# EAGLE design AIO_tracker_V1.0 (EAGLE 6.5.0)
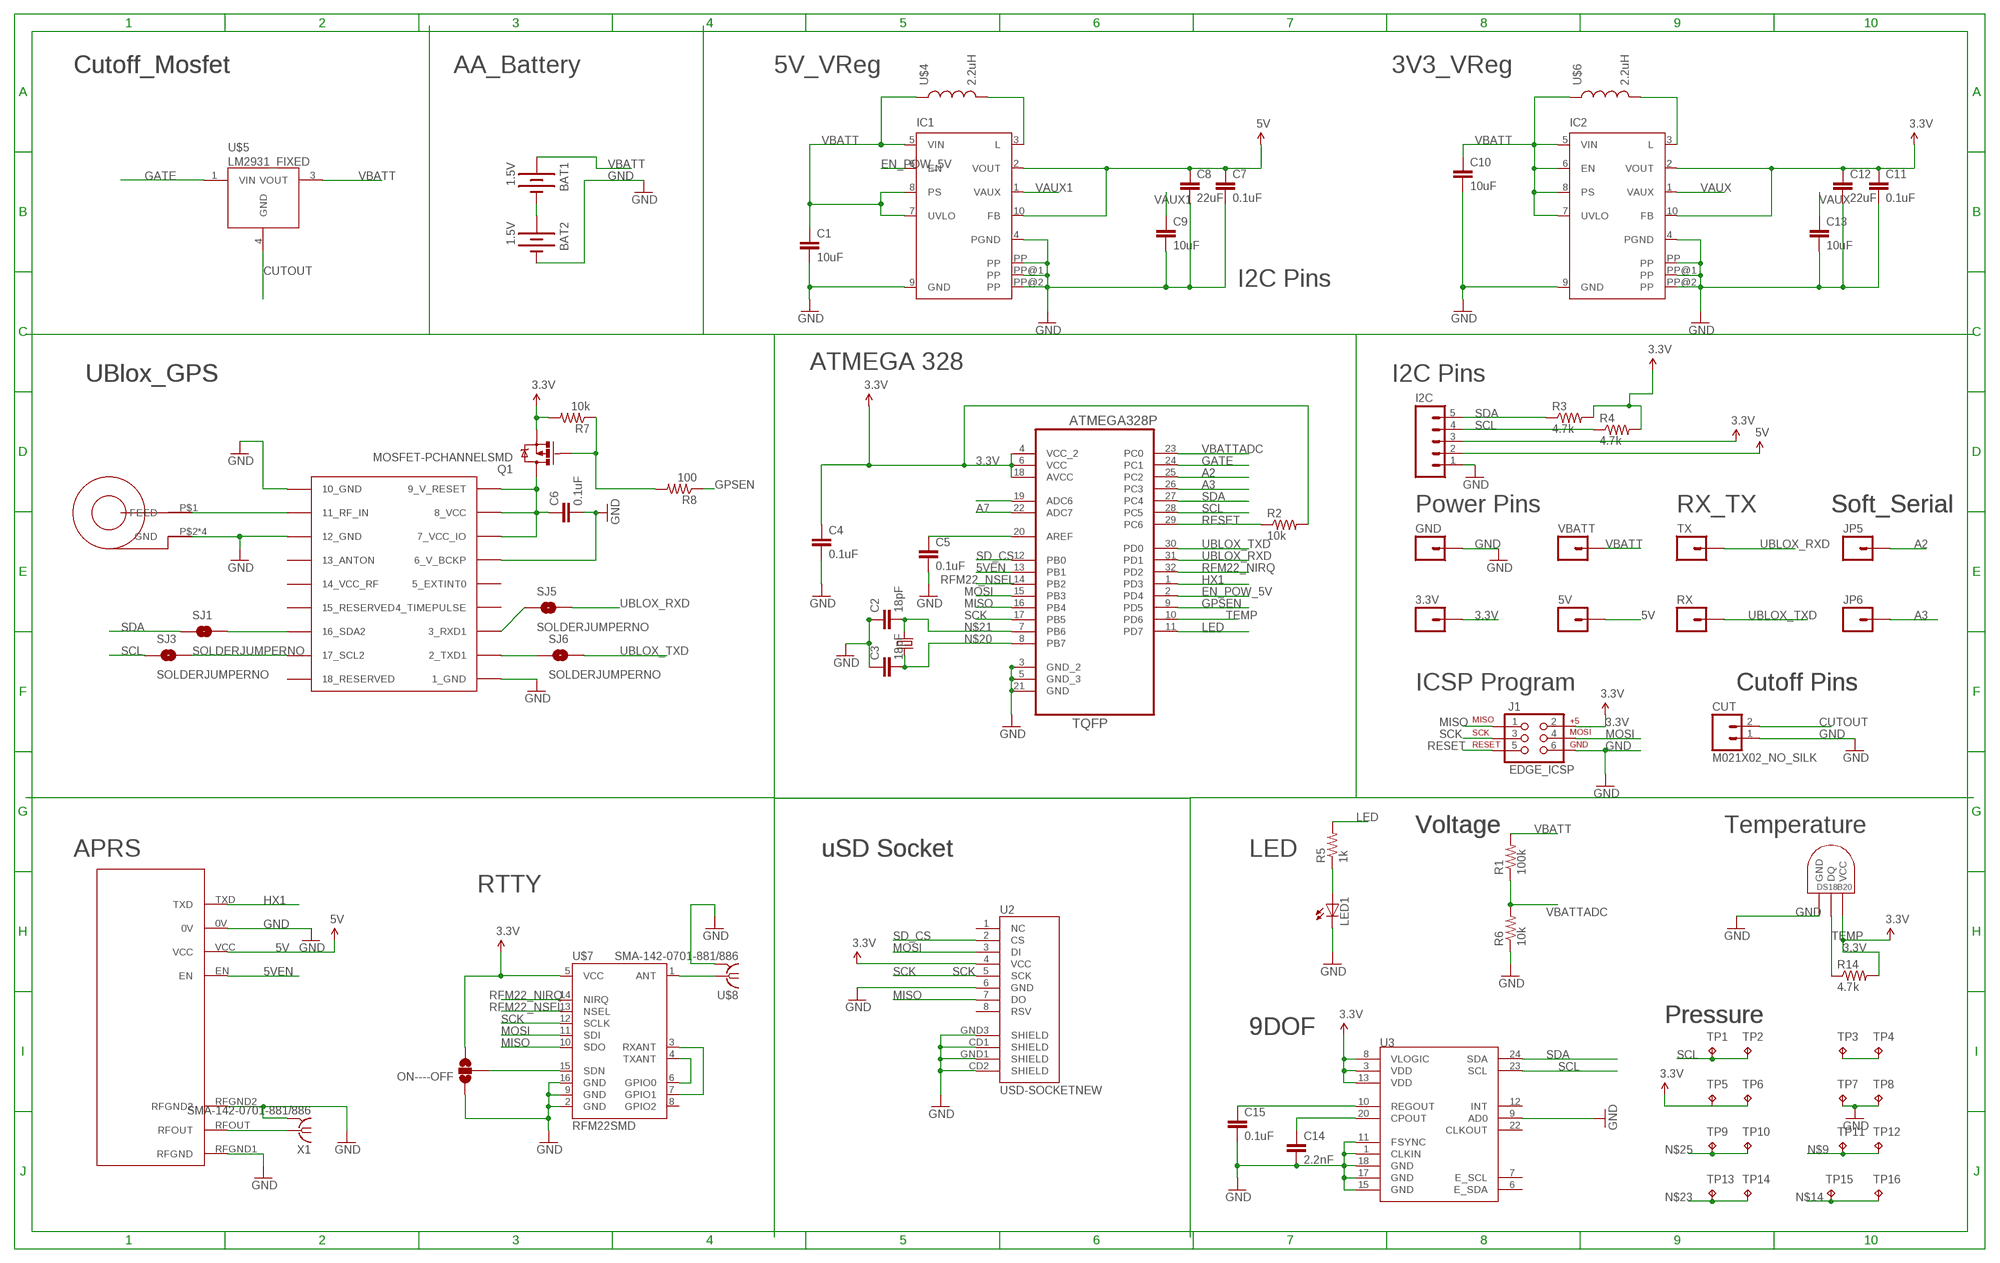
[diagram p0: schematic, sheet 1]

## Parts
3.3V  M01SMDNS  [1X01NS]
5V  M01SMDNS  [1X01NS]
BAT1  1.5V  BATTERYAA-KIT  [BATTERY-AA-KIT]
BAT2  1.5V  BATTERYAA-KIT  [BATTERY-AA-KIT]
C1  10uF  CAP0805  [0805]
C2  18pF  CAP0603-CAP  [0603-CAP]
C3  18pF  CAP0603-CAP  [0603-CAP]
C4  0.1uF  CAP0603-CAP  [0603-CAP]
C5  0.1uF  CAP0603-CAP  [0603-CAP]
C6  0.1uF  CAP0603-CAP  [0603-CAP]
C7  0.1uF  CAP0603-CAP  [0603-CAP]
C8  22uF  CAP0805  [0805]
C9  10uF  CAP0805  [0805]
C10  10uF  CAP0805  [0805]
C11  0.1uF  CAP0603-CAP  [0603-CAP]
C12  22uF  CAP0805  [0805]
C13  10uF  CAP0805  [0805]
C14  2.2nF  CAP0603-CAP  [0603-CAP]
C15  0.1uF  CAP0603-CAP  [0603-CAP]
CUT  M021X02_NO_SILK  [1X02_NO_SILK]
GND  M01SMDNS  [1X01NS]
I2C  M05NO_SILK  [1X05_NO_SILK]
IC1  TPS61201  [S-PDSO-N10]
IC2  TPS61201  [S-PDSO-N10]
J1  EDGE_ICSP  [EDGE_MOUNTED_ICSP]
JP5  M01PTH  [1X01]
JP6  M01PTH  [1X01]
LED1  LED0603  [LED-0603]
ON----OFF  SOLDERJUMPER_2WAY-OLDT  [SJ_2]
Q1  MOSFET-PCHANNELSMD  [SOT23-3]
R1  100k  RESISTOR0603-RES  [0603-RES]
R2  10k  RESISTOR0603-RES  [0603-RES]
R3  4.7k  RESISTOR0603-RES  [0603-RES]
R4  4.7k  RESISTOR0603-RES  [0603-RES]
R5  1k  RESISTOR0603-RES  [0603-RES]
R6  10k  RESISTOR0603-RES  [0603-RES]
R7  10k  RESISTOR0603-RES  [0603-RES]
R8  100  RESISTOR0603-RES  [0603-RES]
R14  4.7k  RESISTOR0603-RES  [0603-RES]
RX  M01PTH  [1X01]
SJ1  SOLDERJUMPERNO  [SJ_2S-NO]
SJ3  SOLDERJUMPERNO  [SJ_2S-NO]
SJ5  SOLDERJUMPERNO  [SJ_2S-NO]
SJ6  SOLDERJUMPERNO  [SJ_2S-NO]
TP1  TPTP10SQ  [TP10SQ]
TP2  TPTP10SQ  [TP10SQ]
TP3  TPTP10SQ  [TP10SQ]
TP4  TPTP10SQ  [TP10SQ]
TP5  TPTP10SQ  [TP10SQ]
TP6  TPTP10SQ  [TP10SQ]
TP7  TPTP10SQ  [TP10SQ]
TP8  TPTP10SQ  [TP10SQ]
TP9  TPTP10SQ  [TP10SQ]
TP10  TPTP10SQ  [TP10SQ]
TP11  TPTP10SQ  [TP10SQ]
TP12  TPTP10SQ  [TP10SQ]
TP13  TPTP10SQ  [TP10SQ]
TP14  TPTP10SQ  [TP10SQ]
TP15  TPTP10SQ  [TP10SQ]
TP16  TPTP10SQ  [TP10SQ]
TX  M01PTH  [1X01]
U1  ATMEGA328P-AU  [QFP80P900X900X120-32N]
U2  USD-SOCKETNEW  [MICRO-SD-SOCKET-PP]
U3  MPU-9150QFN-24-NP  [QFN-24-NP]
U$1  UBLOX_MAX  [UBLOX_MAX]
U$2  JDGA-REMQV-ANTENNA  [JDGA-RIGID_COMBO_PAD]
U$3  NTX2-VERTICAL  [NTX2-VERTICAL]
U$4  2.2uH  COILCRAFT-MSS5131  [COILCRAFT_MSS5131]
U$5  LM2931_FIXED  [DPAK]
U$6  2.2uH  COILCRAFT-MSS5131  [COILCRAFT_MSS5131]
U$7  RFM22SMD  [RFM22-XXX-S2]
U$8  SMA-142-0701-881/886  [J502-ND-142-0701-881/886]
U$9  DS1820  [µSOP8]
VBATT  M01SMDNS  [1X01NS]
X1  SMA-142-0701-881/886  [J502-ND-142-0701-881/886]
Y1  ABRACON_ABM3_CRYSTAL  [ABRACON_ABM3_CRYSTAL]

## Nets
3.3V [3.3V]: 3.3V.1 C4.1 C11.1 C12.1 I2C.3 IC2.2(VOUT) IC2.10(FB) J1.2 ON----OFF.3 Q1.2(S) R2.2 R3.2 R4.2 R7.2 R14.2 TP5.TP TP6.TP U1.4(VCC_2) U1.6(VCC) U1.18(AVCC) U2.4(VCC) U3.3(VDD) U3.8(VLOGIC) U3.13(VDD) U$7.5(VCC) U$9.8(VCC)
5V [5V]: 5V.1 C7.1 C8.1 I2C.2 IC1.2(VOUT) IC1.10(FB) U$3.VCC
5VEN: U1.13(PB1) U$3.EN
A2: JP5.1 U1.25(PC2)
A3: JP6.1 U1.26(PC3)
A7: U1.22(ADC7)
CUTOUT: CUT.2 U$5.4(GND)
EN_POW_5V: IC1.6(EN) U1.2(PD4)
GATE: U1.24(PC1) U$5.1(VIN)
GND [GND]: BAT2.GND@1(-) C1.2 C2.1 C3.1 C4.2 C5.2 C6.2 C7.2 C8.2 C9.2 C10.2 C11.2 C12.2 C13.2 C14.2 C15.2 CUT.1 GND.1 I2C.1 IC1.4(PGND) IC1.9(GND) IC1.PP IC1.PP@1(PP) IC1.PP@2(PP) IC2.4(PGND) IC2.9(GND) IC2.PP IC2.PP@1(PP) IC2.PP@2(PP) J1.6 LED1.C ON----OFF.1 R6.1 TP7.TP TP8.TP U1.3(GND_2) U1.5(GND_3) U1.21(GND) U2.6(GND) U2.CD1(SHIELD) U2.CD2(SHIELD) U2.GND1(SHIELD) U2.GND3(SHIELD) U3.1(CLKIN) U3.9(AD0) U3.11(FSYNC) U3.15(GND) U3.17(GND) U3.18(GND) U$1.1_GND U$1.6_V_BCKP U$1.10_GND U$1.12_GND U$2.P$2(GND) U$2.P$3(GND) U$2.P$4(GND) U$2.P$5(GND) U$3.0V U$3.RFGND1(RFGND) U$3.RFGND2 U$7.2(GND) U$7.9(GND) U$7.16(GND) U$8.G@1 U$8.G@2 U$8.G@3 U$8.G@4 U$9.4(GND) X1.G@1 X1.G@2 X1.G@3 X1.G@4
GPSEN: R8.1 U1.9(PD5)
HX1: U1.1(PD3) U$3.TXD
LED: R5.2 U1.11(PD7)
MISO: J1.1 U1.16(PB4) U2.7(DO) U$7.10(SDO)
MOSI: J1.4 U1.15(PB3) U2.3(DI) U$7.11(SDI)
N$1: LED1.A R5.1
N$2: Q1.1(G) R7.1 R8.2
N$3: U$1.11_RF_IN U$2.P$1(FEED)
N$4: C5.1 U1.20(AREF)
N$5: U$3.RFOUT X1.1
N$6: C6.1 Q1.3(D) U$1.7_VCC_IO U$1.8_VCC U$1.9_V_RESET
N$7: IC1.3(L) U$4.P$1
N$9: TP11.TP TP12.TP
N$10: BAT1.GND@1(-) BAT2.PWR@1(+)
N$11: SJ5.1 U$1.3_RXD1
N$12: SJ6.1 U$1.2_TXD1
N$13: U$7.1(ANT) U$8.1
N$14: TP15.TP TP16.TP
N$15: SJ1.2 U$1.16_SDA2
N$16: SJ3.2 U$1.17_SCL2
N$17: C15.1 U3.10(REGOUT)
N$18: C14.1 U3.20(CPOUT)
N$19: IC2.3(L) U$6.P$1
N$20: C3.2 U1.8(PB7) Y1.P$1
N$21: C2.2 U1.7(PB6) Y1.P$2
N$23: TP13.TP TP14.TP
N$24: U1.19(ADC6)
N$25: TP9.TP TP10.TP
N$26: ON----OFF.2 U$7.15(SDN)
N$29: U$7.3(RXANT) U$7.7(GPIO1)
N$30: U$7.4(TXANT) U$7.6(GPIO0)
RESET: J1.5 R2.1 U1.29(PC6)
RFM22_NIRQ: U1.32(PD2) U$7.14(NIRQ)
RFM22_NSEL: U1.14(PB2) U$7.13(NSEL)
SCK: J1.3 U1.17(PB5) U2.5(SCK) U$7.12(SCLK)
SCL: I2C.4 R4.1 SJ3.1 TP1.TP TP2.TP U1.28(PC5) U3.23(SCL)
SD_CS: U1.12(PB0) U2.2(CS)
SDA: I2C.5 R3.1 SJ1.1 TP3.TP TP4.TP U1.27(PC4) U3.24(SDA)
TEMP: R14.1 U1.10(PD6) U$9.1(DQ)
UBLOX_RXD: SJ5.2 TX.1 U1.31(PD1)
UBLOX_TXD: RX.1 SJ6.2 U1.30(PD0)
VAUX: C13.1 IC2.1(VAUX)
VAUX1: C9.1 IC1.1(VAUX)
VBATT [bat]: BAT1.PWR@1(+) C1.1 C10.1 IC1.5(VIN) IC1.7(UVLO) IC1.8(PS) IC2.5(VIN) IC2.6(EN) IC2.7(UVLO) IC2.8(PS) R1.2 U$4.P$2 U$5.3(VOUT) U$6.P$2 VBATT.1
VBATTADC: R1.1 R6.2 U1.23(PC0)
Unconnected: U2.1(NC) U2.8(RSV) U3.6(E_SDA) U3.7(E_SCL) U3.12(INT) U3.22(CLKOUT) U$1.4_TIMEPULSE U$1.5_EXTINT0 U$1.13_ANTON U$1.14_VCC_RF U$1.15_RESERVED U$1.18_RESERVED U$7.8(GPIO2)

## Notes on the sheet
- Cutoff_Mosfet | Cutoff_Mosfet | AA_Battery | 5V_VReg | 3V3_VReg
- I2C Pins
- ATMEGA 328
- UBlox_GPS | UBlox_GPS | I2C Pins
- Power Pins | RX_TX | Soft_Serial | Soft_Serial
- ICSP Program | Cutoff Pins | Cutoff Pins
- Voltage | Voltage | Temperature
- APRS | uSD Socket | uSD Socket | LED
- RTTY
- Pressure | Pressure
- 9DOF | 9DOF

## Library data of the parts
3.3V 5V GND JP5 JP6 RX TX VBATT = SparkFun-Connectors:M01: Header 1 Standard 1-pin 0.1" header. Use with straight break away headers (SKU : PRT-00116), right angle break away headers (PRT-00553), swiss pins (PRT-00743), machine pins (PRT-00117), and female headers (PRT-00115).
BAT1 BAT2 = SparkFun-Electromechanical:BATTERY: Battery Holders Various common sizes : AA, AAA, 20mm coin cell and 12mm coin cell. 20MM_4LEGS, BATT-10373; PROD_ID: BATT-08316
C1-C15 = SparkFun-Passives:CAP: Capacitor Standard 0603 ceramic capacitor, and 0.1" leaded capacitor.
CUT = SparkFun-Connectors:M02: Standard 2-pin 0.1" header. Use with - straight break away headers ( PRT-00116) - right angle break away headers (PRT-00553) - swiss pins (PRT-00743) - machine pins (PRT-00117) - female headers (PRT-00115) Molex polarized connector foot print use with: PRT-08233 with associated crimp pins and housings. 2.54_SCREWTERM for use with PRT-10571. 3.5mm Screw Terminal footprints for PRT-08084 5mm Screw Terminal footprints for use with PRT-08433
I2C = SparkFun-Connectors:M05: Header 5 Standard 5-pin 0.1" header. Use with straight break away headers (SKU : PRT-00116), right angle break away headers (PRT-00553), swiss pins (PRT-00743), machine pins (PRT-00117), and female headers (PRT-00115). Molex polarized connector foot print use with SKU : PRT-08230 with associated crimp pins and housings.
IC1 IC2 = texas:TPS6120*: LOW INPUT VOLTAGE SYNCHRONOUS BOOST CONVERTER WITH 1.3-A SWITCHES Source: http://focus.ti.com/lit/ds/symlink/tps61200.pdf; MPN: TPS61201DRCT; OC_FARNELL: unknown; OC_NEWARK: 37M0068
J1 = Ava:EDGE_ICSP
LED1 = SparkFun-LED:LED: LEDs Standard schematic elements and footprints for 5mm, 3mm, 1206, and 0603 sized LEDs. 5mm - Spark Fun Electronics SKU : COM-00529 (and others)
ON----OFF = SparkFun-Passives:SOLDERJUMPER_2WAY-OLD: Solder Jumper 2 way solder jumper
Q1 = SparkFun-DiscreteSemi:MOSFET-PCHANNEL: Generic PMOSFET
R1-R8 R14 = SparkFun-Passives:RESISTOR: Resistor Basic schematic elements and footprints for 0603, 1206, and PTH resistors.
SJ1 SJ3 SJ5 SJ6 = SparkFun-Passives:SOLDERJUMPER: Solder Jumper Standard SMD solder jumper. Used to automate production. Two varients : Normally Open and Normally Closed are the same, but have different paste layers. NC will have a large amount of paste and should jumper during reflow.
TP1-TP16 = testpad:TP: Test pad
U1 = Ava:ATMEGA328P-AU; DESCRIPTION: 8-bit Microcontroller with In-System Programmable Flash; MPN: ATMEGA328P-AU; OC_FARNELL: 1715486; OC_NEWARK: 14R4631; PACKAGE: TQFP-32; SUPPLIER: Atmel
U2 = SparkFun-Connectors:USD-SOCKET: microSD Socket Push-push type uSD socket. Schematic element and footprint production proven. Spark Fun Electronics SKU : PRT-00127. tDoc lines correctly indicate media card edge positions when inserting (unlocked, locked, depressed).
U3 = SparkFun-Sensors:MPU-9150: 9DOF (3mag, 3accel, 3rotat). I2C interface.
U$1 = Ava:UBLOX_MAX: UBLOX MAX
U$2 = Ava:JDGA-REMQV-ANTENNA
U$3 = Ava:NTX2-VERTICAL: Radiometrix NTX2 Transmitter Module Author Anthony Stirk / http://ava.upuaut.net
U$4 U$6 = Ava:COILCRAFT-MSS5131
U$5 = SparkFun-PowerIC:LM2931_FIXED: LDO regulator with reverse battery protection- very durable!
U$7 = SparkFun-RF:RFM22: The RFM22 is a low-power, low cost radio that is capable of operating in the 434MHz and 900MHz open bands. It's frequency is software defined and there are some very good libraries written for it.
U$8 X1 = con-coax:SMA-: SMA 50 Ohm End Launch Jack Receptacle - Round Contact Johnson Components Source: www.johnsoncomponents.com .. J502-ND.pdf; MF: JOHNSON COMPONENTS; MPN: 142-0701-881; OC_FARNELL: 1608603; OC_NEWARK: 08B906
U$9 = Ava:DS1820: DS18B20 Programmable Resolution 1-Wire Digital Thermometer Description The DS18B20 digital thermometer provides 9-bit to 12-bit Celsius temperature measurements and has an alarm function with nonvolatile user-programmable upper and lower trigger points. The DS18B20 communicates over a 1-Wire® bus that by definition requires only one data line (and ground) for communication with a central microprocessor. It has an operating temperature range of -55°C to +125°C and is accurate to ±0.5°C over the range of -10°C to +85°C. In addition, the DS18B20 can derive power directly from the data line ("parasite power"), eliminating the need for an external power supply. Each DS18B20 has a unique 64-bit serial code, which allows multiple DS18B20s to function on the same 1-Wire bus. Thus, it is simple to use one microprocessor to control many DS18B20s distributed over a large area. Applications that can benefit from this feature include HVAC environmental controls, temperature monitoring systems inside buildings, equipment, or machinery, and process monitoring and control systems.
Y1 = Ava:ABRACON_ABM3_CRYSTAL

## Net classes
0 default: width 0.254 mm, drill 0.4 mm, clearance 0.254 mm
1 bat: width 0.254 mm, drill 0.4 mm, clearance 0.254 mm to class 0, clearance 0.254 mm
2 5V: width 0.254 mm, drill 0.4 mm, clearance 0.254 mm to class 0, clearance 0.254 mm to class 1, clearance 0.254 mm
3 3.3V: width 0.254 mm, drill 0.4 mm, clearance 0.254 mm to class 0, clearance 0.254 mm to class 1, clearance 0.254 mm to class 2, clearance 0.254 mm
4 GND: width 0.254 mm, drill 0.4 mm, clearance 0.254 mm to class 0, clearance 0.254 mm to class 1, clearance 0.254 mm to class 2, clearance 0.254 mm to class 3, clearance 0.254 mm

## Board
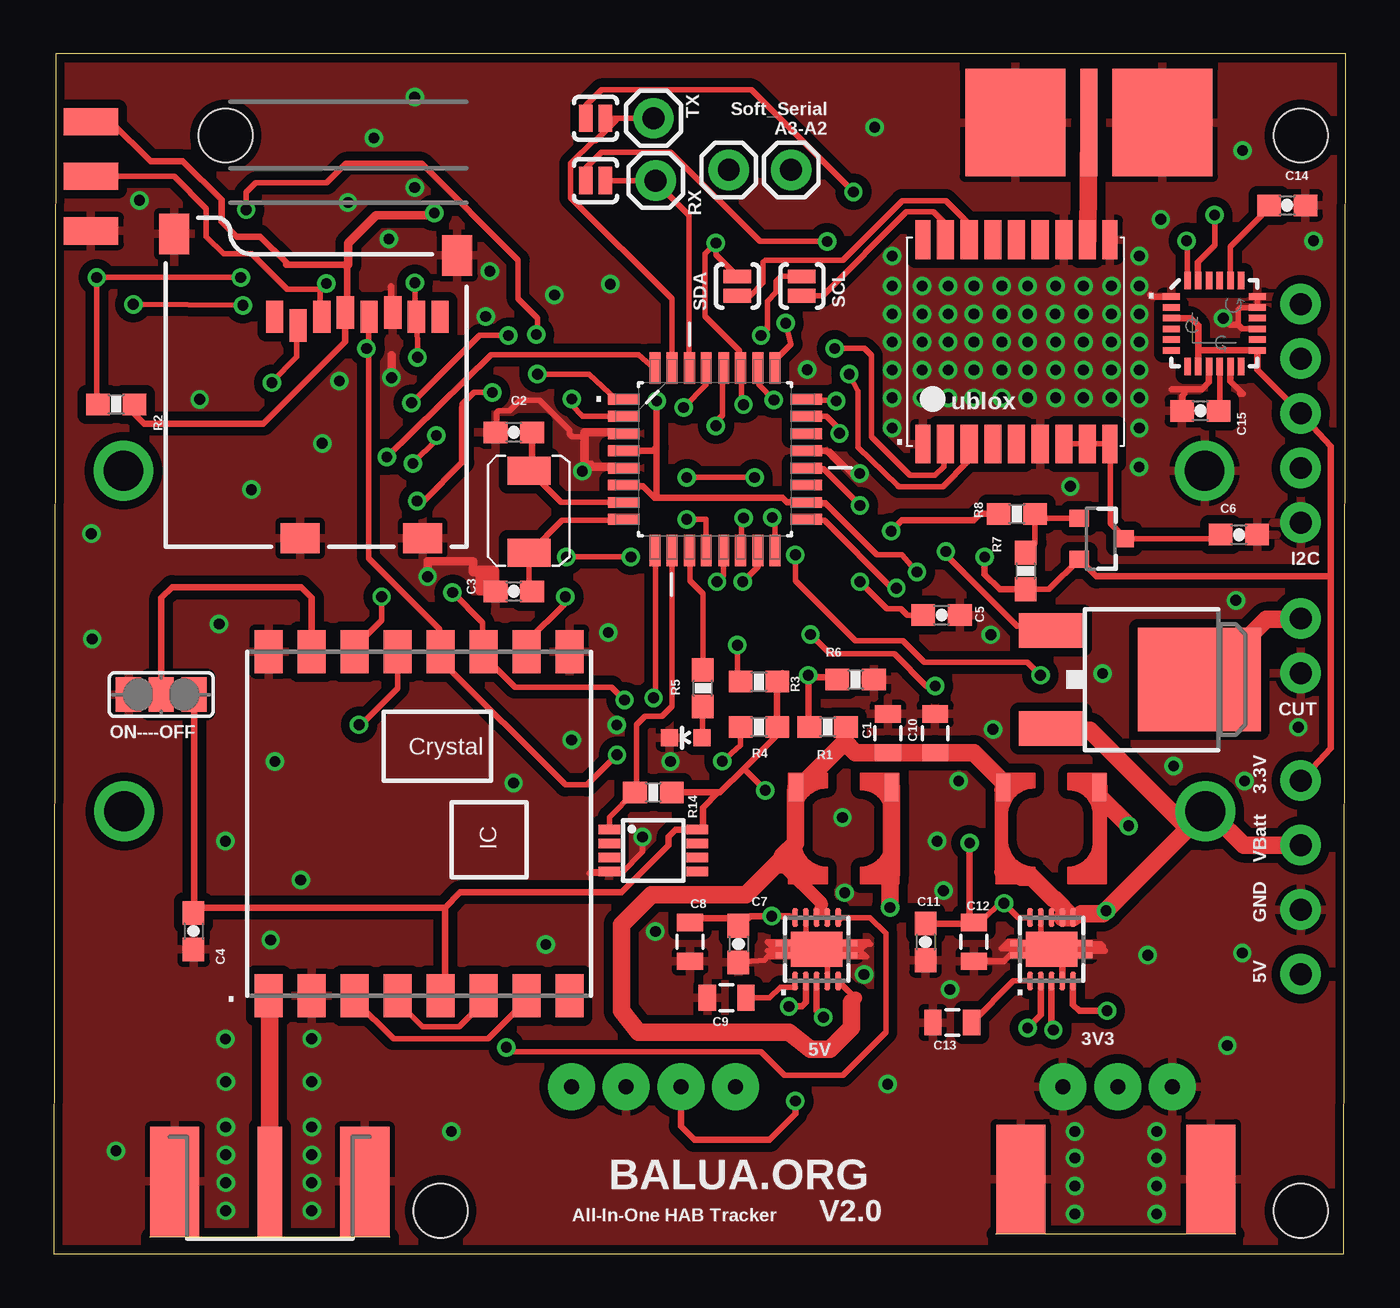
[diagram p1: board, top side]
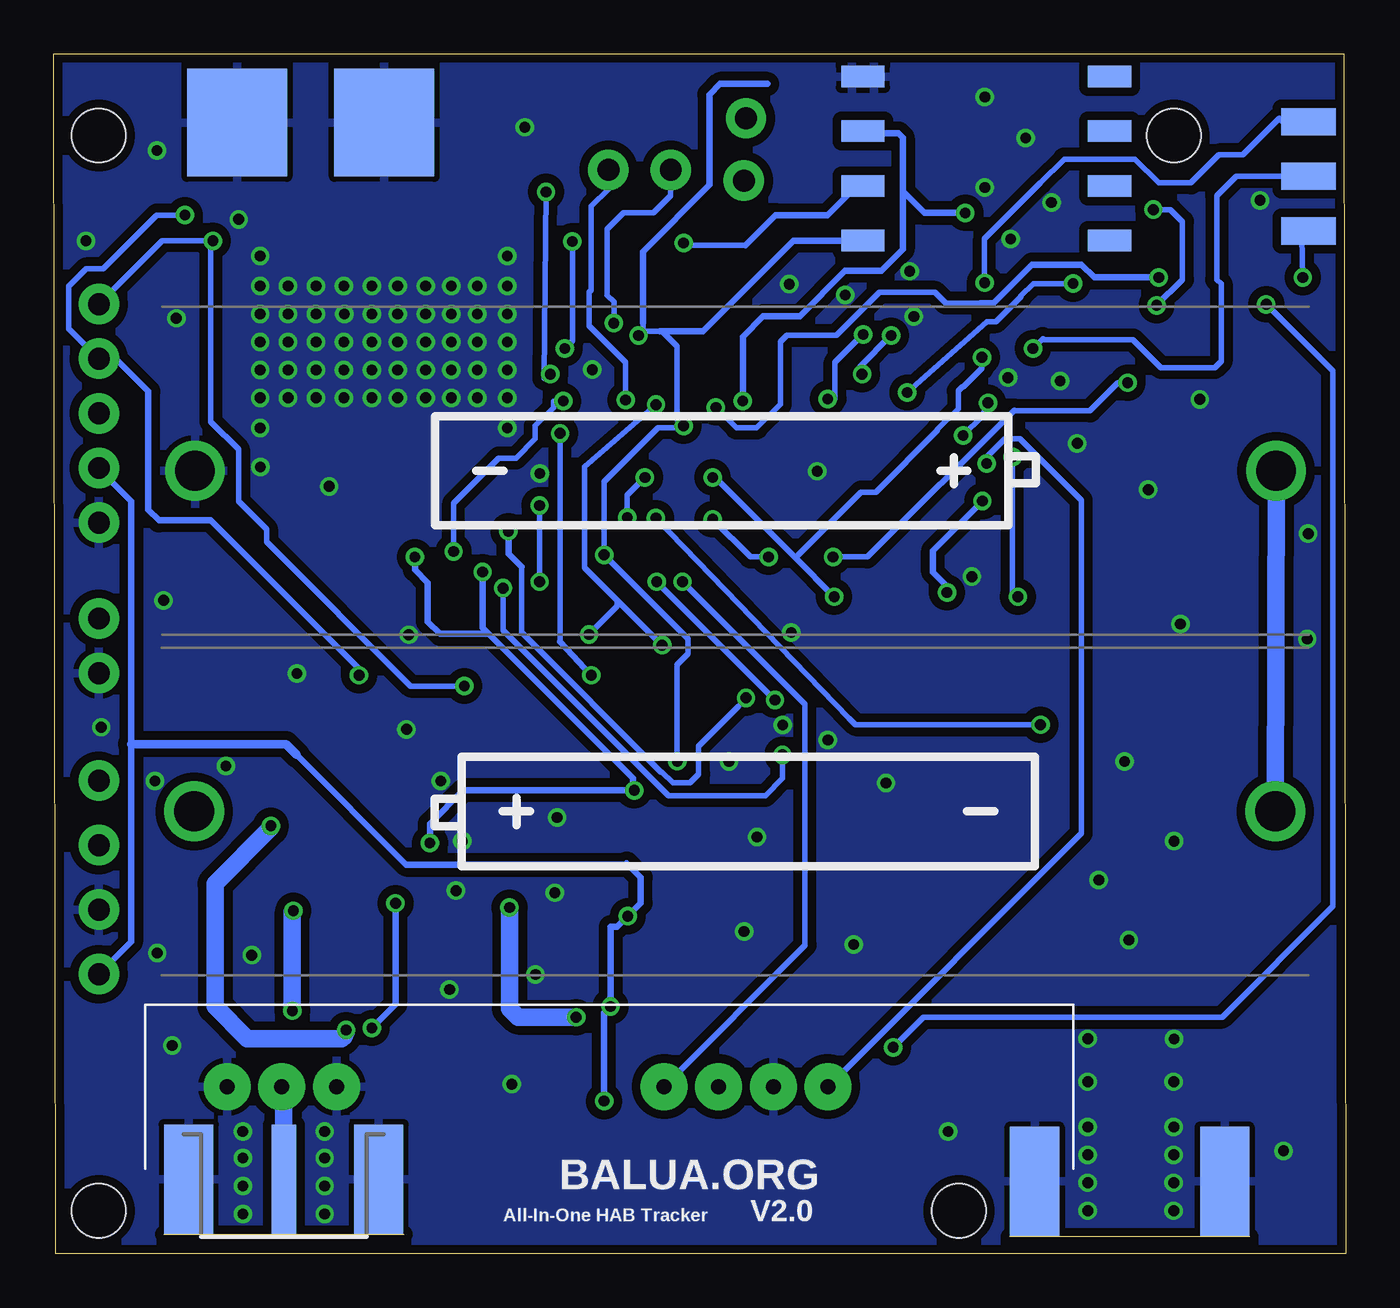
[diagram p2: board, bottom side, seen from below]

Size 60.1 x 55.8 mm. Coordinates in mm from the lower left corner, seen from the top.
Outline: 0,0 60,0 60.1,55.8 0.1,55.8 0,0
Copper layers (1*16): Top 0.0356mm / dielectric 1.5011mm / Bottom 0.0356mm
Design rules "oshpark-2layer *": minimum track width 6mil, minimum drill 13mil, track to track 6mil, track to pad 6mil, pad to pad 6mil, via to via 6mil, smd to smd 6mil, copper to edge 15mil, drill to drill 6mil, minimum pad ring 7mil, minimum via ring 7mil, stop-mask expansion 4mil, vias tented up to drill 25mil, thermal gap 10mil
Holes 2.5 mm at 8,52 18,2 58,2 58,52

### Footprints (pad centres in the part's own frame; a part is rotated, then mirrored left to right if it is on the bottom)
1X01NS = drill 1.016 pad 1.88: 1 0,0
BATTERY-AA-KIT = drill 1.854: GND@1 25.146,0; PWR@1 -25.146,0
0805 = smd 0.8 x 1.2: 1 -0.9,0; 2 0.9,0
0603-CAP = smd 1.1 x 1: 1 -0.85,0; 2 0.85,0
1X02_NO_SILK = drill 1.016 pad 1.88: 1 0,0; 2 2.54,0
1X05_NO_SILK = drill 1.016 pad 1.88: 1 0,0; 2 2.54,0; 3 5.08,0; 4 7.62,0; 5 10.16,0
S-PDSO-N10 = smd 0.28 x 0.85: 1 -1,-1.475; 2 -0.5,-1.475; 3 0,-1.475; 4 0.5,-1.475; 5 1,-1.475; 6 1,1.475; 7 0.5,1.475; 8 0,1.475; 9 -0.5,1.475; 10 -1,1.475 | smd 2.4 x 1.65: PP 0,0 | smd 3.8 x 0.28: PP@1 0,0.275; PP@2 0,-0.275
EDGE_MOUNTED_ICSP = smd 1.27 x 2.54 bottom: 1 -2.54,0; 3 0,0; 5 2.54,0 | smd 1.27 x 2.54: 2 -2.54,0; 4 0,0; 6 2.54,0
1X01 = drill 1.016 pad 1.88: 1 0,0
LED-0603 = smd 0.8 x 0.8: A 0,-0.75; C 0,0.75
SJ_2 = smd 1.168 x 1.6: 1 -1.524,0; 2 0,0; 3 1.524,0
SOT23-3 = smd 0.8 x 0.9: 1 -0.95,-1; 2 0.95,-1; 3 0,1.1
0603-RES = smd 1.1 x 1: 1 -0.85,0; 2 0.85,0
SJ_2S-NO = smd 0.635 x 1.27: 1 -0.45,0; 2 0.45,0
TP10SQ = smd 1 x 1: TP 0,0
QFP80P900X900X120-32N = smd 1.473 x 0.508: 1 -4.242,2.794; 2 -4.242,2.007; 3 -4.242,1.194; 4 -4.242,0.406; 5 -4.242,-0.406; 6 -4.242,-1.194; 7 -4.242,-2.007; 8 -4.242,-2.794; 17 4.242,-2.794; 18 4.242,-2.007; 19 4.242,-1.194; 20 4.242,-0.406; 21 4.242,0.406; 22 4.242,1.194; 23 4.242,2.007; 24 4.242,2.794 | smd 0.508 x 1.473: 9 -2.794,-4.242; 10 -2.007,-4.242; 11 -1.194,-4.242; 12 -0.406,-4.242; 13 0.406,-4.242; 14 1.194,-4.242; 15 2.007,-4.242; 16 2.794,-4.242; 25 2.794,4.242; 26 2.007,4.242; 27 1.194,4.242; 28 0.406,4.242; 29 -0.406,4.242; 30 -1.194,4.242; 31 -2.007,4.242; 32 -2.794,4.242
MICRO-SD-SOCKET-PP = smd 0.8 x 1.5: 1 -8.94,10.7; 2 -7.84,10.3; 3 -6.74,10.7; 4 -5.64,10.9; 5 -4.54,10.7; 6 -3.44,10.9; 7 -2.34,10.7; 8 -1.24,10.7 | smd 1.8 x 1.4: CD1 -2.05,0.4; CD2 -7.75,0.4 | smd 1.4 x 1.9: GND1 -13.6,14.55; GND3 -0.45,13.55
QFN-24-NP = smd 0.8 x 0.3: 1 -2,1.25; 2 -2,0.75; 3 -2,0.25; 4 -2,-0.25; 5 -2,-0.75; 6 -2,-1.25; 13 2,-1.25; 14 2,-0.75; 15 2,-0.25; 16 2,0.25; 17 2,0.75; 18 2,1.25 | smd 0.3 x 0.8: 7 -1.25,-2; 8 -0.75,-2; 9 -0.25,-2; 10 0.25,-2; 11 0.75,-2; 12 1.25,-2; 19 1.25,2; 20 0.75,2; 21 0.25,2; 22 -0.25,2; 23 -0.75,2; 24 -1.25,2
UBLOX_MAX = smd 1.8 x 0.7: 1_GND 4.95,-4.4; 9_V_RESET 4.95,4.3; 10_GND -4.55,4.3; 18_RESERVED -4.55,-4.4 | smd 1.8 x 0.8: 2_TXD1 4.95,-3.35; 3_RXD1 4.95,-2.25; 4_TIMEPULSE 4.95,-1.15; 5_EXTINT0 4.95,-0.05; 6_V_BCKP 4.95,1.05; 7_VCC_IO 4.95,2.15; 8_VCC 4.95,3.25; 11_RF_IN -4.55,3.25; 12_GND -4.55,2.15; 13_ANTON -4.55,1.05; 14_VCC_RF -4.55,-0.05; 15_RESERVED -4.55,-1.15; 16_SDA2 -4.55,-2.25; 17_SCL2 -4.55,-3.35
JDGA-RIGID_COMBO_PAD = smd 0.8 x 5: P$1 0,0 | smd 4.65 x 5: P$2 -3.425,0; P$3 3.425,0 | smd 4.65 x 5 bottom: P$4 -3.425,0; P$5 3.425,0
NTX2-VERTICAL = drill 0.7 pad 2.184: 0V 17.78,0; EN 12.7,0; RFGND1 -7.62,0; RFGND2 -2.54,0; RFOUT -5.08,0; TXD 20.32,0; VCC 15.24,0
COILCRAFT_MSS5131 = smd 1.27 x 0.635: P$1 -1.905,2.223; P$2 -1.905,-2.223
DPAK = smd 1.6 x 3: 1 -2.28,-5.31; 3 2.28,-5.31 | smd 4.826 x 5.715: 4 0,1.588
RFM22-XXX-S2 = smd 2 x 1.3: 1 -8,7; 2 -8,5; 3 -8,3; 4 -8,1; 5 -8,-1; 6 -8,-3; 7 -8,-5; 8 -8,-7; 9 8,-7; 10 8,-5; 11 8,-3; 12 8,-1; 13 8,1; 14 8,3; 15 8,5; 16 8,7
J502-ND-142-0701-881/886 = smd 5.08 x 1.143: 1 2.565,0 | smd 5.08 x 2.286: G@1 2.565,4.42; G@2 2.565,-4.42 | smd 5.08 x 2.286 bottom: G@3 2.565,4.42; G@4 2.565,-4.42
µSOP8 = smd 0.45 x 1: 1 -0.975,-2.05; 2 -0.325,-2.05; 3 0.325,-2.05; 4 0.975,-2.05; 5 0.975,2.05; 6 0.325,2.05; 7 -0.325,2.05; 8 -0.975,2.05
ABRACON_ABM3_CRYSTAL = smd 1.3 x 2: P$1 -3.4,0.1; P$2 0.4,0.1

### Placement (x,y rotation side)
3.3V  58,22 0 top
5V  58,13 0 top
BAT1  28.42,20.57 0 bottom
BAT2  28.39,36.41 180 bottom
C1  38.8,24.2 90 top
C2  21.4,38.2 0 top
C3  21.4,30.8 0 top
C4  6.5,15 270 top
C5  41.3,29.7 0 top
C6  55.13,33.44 0 top
C7  31.85,14.4 270 top
C8  29.6,14.5 270 top
C9  31.3,11.9 180 top
C10  41,24.2 90 top
C11  40.55,14.5 270 top
C12  42.8,14.5 270 top
C13  41.8,10.75 180 top
C14  57.38,48.75 0 top
C15  53.34,39.2 180 top
CUT  58,27 90 top
GND  58,16 0 top
I2C  58,34 90 top
IC1  35.49,14.16 0 top
IC2  46.41,14.16 0 top
J1  1.73,50.1 270 top
JP5  31.4,50.4 180 top
JP6  34.3,50.4 180 top
LED1  29.4,24 90 top
ON----OFF  5,26 0 top
Q1  48.7,33.25 270 top
R1  36,24.5 0 top
R2  2.9,39.5 0 top
R3  32.8,26.6 0 top
R4  32.8,24.5 0 top
R5  30.2,26.3 90 top
R6  37.3,26.7 180 top
R7  45.2,31.75 270 top
R8  44.8,34.4 0 top
R14  27.89,21.45 0 top
RX  28,49.9 90 top
SJ1  31.8,45 270 top
SJ3  34.8,45 270 top
SJ5  25.2,52.8 0 top
SJ6  25.2,49.9 0 top
TP1  21.95,47.12 270 bottom
TP2  22.96,47.12 270 bottom
TP3  22.96,49.66 180 bottom
TP4  21.95,49.66 180 bottom
TP5  22.96,52.2 180 bottom
TP6  21.95,52.2 180 bottom
TP7  22.96,54.74 180 bottom
TP8  21.95,54.74 180 bottom
TP9  10.47,52.2 180 bottom
TP10  11.48,52.2 180 bottom
TP11  11.48,47.12 180 bottom
TP12  10.47,47.12 180 bottom
TP13  10.47,54.74 180 bottom
TP14  11.48,54.74 180 bottom
TP15  11.48,49.66 180 bottom
TP16  10.47,49.66 180 bottom
TX  27.9,52.8 90 top
U1  30.76,36.94 0 top
U2  19.21,32.87 0 top
U3  53.98,43.26 0 top
U$1  44.83,42.6 270 top
U$2  48.15,52.6 180 top
U$3  44.41,7.77 0 bottom
U$4  36.75,19.78 270 top
U$5  51.7,26.7 270 top
U$6  46.4,19.78 270 top
U$7  17,20 90 top
U$8  10.05,0.8 90 top
U$9  27.89,18.75 270 top
VBATT  58,19 0 top
X1  49.4,0.9 90 bottom
Y1  22.2,36 90 top

### Tracks (layer width: path | path; a pad name or v marks a point on that pad's centre or on a via)
3.3V  (via drill 0.5 pad 0.3, 0.5 pad 0.41)
  Top 0.254: 45.38,15.6 IC2.10 44.86,15.63 v44.2,16.3 44,16.3 43.3,15.6 43.3,15.5 43.2,15.4 C12.1 | IC2.2 45.9,11.1 | 47.4,32.3 Q1.2 | Q1.2 47.7,32.2 | 45.1,31 R7.2 46.3,30.9 Q1.2 | 37.5,33.3 38.3,32.5 39.45,32.5 v40.15,31.7 | 5.4,50.8 5,50.8 | J1.2 2.16,52.64 | U$9.8 30.02,19.73 30.2,19.9 | 6.15,16.1 C4.1
  Top 0.305: 30.9,21.45 31,21.45 32.1,22.55 | 30.9,21.45 R14.2 | 32.1,22.55 33.65,24.1 R4.2 R3.2 | 32.1,22.55 v33.1,21.55 | 40.4,15.4 C11.1 42.75,15.35 C12.1 42.6,15.6 v42.6,19.1 | 3.8,39.85 R2.2 3.79,39.01 4.2,38.6 9.75,38.6 13.55,42.4 13.55,43.75 U2.4 13.65,43.9 13.65,45.95 | 13.7,46 13.6,46 10.8,46 10.8,46.1 9.6,47.3 8.5,47.3 7.8,48 7.8,49 6,50.8 5,50.8 4.5,50.8 2.66,52.64 J1.2 1.97,52.4 | 59.4,31.5 59.4,37.55 58,39.05 I2C.3 55.98,41.1 U3.13 53.33,42.01 53.23,42.1 | 59.4,31.5 59.4,23.5 3.3V.1 | 28.05,35.15 27.95,35.15 27.4,35.7 26.55,35.7 U1.6 | 28.05,35.15 33.9,35.15 34.1,34.95 35,34.95 U1.18 35.15,34.9 35.9,34.9 37.5,33.3 | 47.85,32.25 Q1.2 48.5,31.5 59.4,31.5 | 28.05,35.15 28.05,37.5 | 28.05,37.5 v28.05,39.65 | U1.4 27.9,37.35 28.05,37.5 | IC2.2 45.91,11.11 45.9,11.1 v45.3,10.5 | R3.2 33.9,26.85 33.9,27 | R3.2 33.6,26.6 | v17.7,48.4 17.6,48.4 17.5,48.3 | U3.8 53.23,42.1 | 53.23,42.1 53.23,43.17 52.9,43.5 51.99,43.5 U3.3 | 30.2,19.9 30.2,20.75 30.9,21.45 | 29.93,19.73 U$9.8 28.93,19.73 28.6,19.4 28.6,19 26.4,16.8 18.9,16.8 18.2,16.1 | 18.2,16.1 18.2,12.2 U$7.5 | v43.3,32.4 43.3,31.6 44,30.9 R7.2 | 18.2,16.1 6.5,16.1 C4.1 6.52,15.87 ON----OFF.3
  Top 0.406: 17.5,48.3 15,48.3 13.7,47 13.7,46 | 13.65,45.95 13.6,46
  Bottom 0.254: TP5.TP TP6.TP
  Bottom 0.305: v28.05,39.65 28.05,42.65 27.1,43.6 25.4,43.6 23.3,45.7 21.6,45.7 20.6,46.7 20.6,49.4 | 39.88,28.82 40.15,29.1 v40.15,31.7 | 39.88,28.82 33.15,22.1 33.15,21.7 v33.1,21.55 | v33.1,21.55 33.1,21.4 | v33.1,21.55 41.05,21.55 42.6,20 v42.6,19.1 | v45.3,10.5 44.2,11.6 v44.2,16.3 | 39.88,28.82 42.12,28.82 42.7,29.4 42.7,31.2 43.3,31.8 v43.3,32.4 | TP6.TP 21.85,52.1 20.8,52.1 20.6,51.9 20.6,49.4 | 20.6,49.4 19.6,48.4 v17.7,48.4
5V  (via drill 0.5 pad 0.41)
  Top 0.305: C8.1 29.85,15.35 29.85,15.45 30,15.6 31.6,15.6 C7.1 32.05,15.35 32.4,15.7 v33.4,15.7 34.23,15.7 IC1.10 | U$3.VCC 29.17,5.93 29.8,5.3 33.3,5.3 34.5,6.5 v34.5,7.1 | v34.2,11.5 34.8,11.5 34.99,11.69 IC1.2
  Bottom 0.305: I2C.2 58,36.5 56.5,35 56.5,23.7 56.5,14.5 5V.1 | v34.5,7.1 34.5,11.2 v34.2,11.5 34.2,15.2 33.9,15.2 v33.4,15.7 32.8,16.3 32.8,17.5 33.45,18.15 33.5,18.1 43.7,18.1 48.8,23.2
  Bottom 0.406: 48.8,23.2 49.3,23.7 56.5,23.7
5VEN  (via drill 0.5 pad 0.41)
  Top 0.254: v30.85,31.25 31.15,31.55 31.15,32.65 U1.13
  Bottom 0.254: v30.85,31.25 25.15,25.55 25.15,14.35 31.7,7.8 U$3.EN
A2  (via drill 0.5 pad 0.41)
  Top 0.254: v34.04,43.27 34.3,42.3 33.6,41.6 33.6,41.2 U1.25
  Bottom 0.254: JP5.1 31.4,49.2 32.2,48.4 33.6,48.4 34.36,47.64 34.36,44.57 34.04,44.26 v34.04,43.27
A3  (via drill 0.5 pad 0.41)
  Top 0.254: v33.5,39.7 32.8,40.4 32.8,41.15 U1.26
  Bottom 0.254: v33.5,39.7 33.5,41.45 35.2,43.15 35.2,44.7 35.1,44.8 35.1,48.7 34.3,49.5 JP6.1
CUTOUT
  Top 0.254: 58,29.5 CUT.2 | 52.7,26.8 U$5.4
  Top 0.813: 58,29.5 56.4,29.5 54.7,27.8 53.69,27.8 U$5.4
EN_POW_5V  (via drill 0.5, 0.5 pad 0.41)
  Top 0.254: 36.55,15.5 36.55,15.57 IC1.6 37.97,15.63 38.7,14.9 38.7,10.3 36.7,8.3 34,8.3 32.9,9.4 21.25,9.4 v21.05,9.6 | v3.7,44.15 v8.8,44.1 | U1.2 26.5,38.95 24.6,38.95 24.1,39.45 v24.1,39.75 | v22.45,42.75 22.5,42.8 22.5,43.5 21.6,44.4 21.6,46.2 17.1,50.7 13.6,50.7 12.7,49.8 9.4,49.8 8.95,49.35 v8.95,48.55
  Bottom 0.254: 8.5,44.15 v8.8,44.1 7.6,45.3 7.6,48 8.15,48.55 v8.95,48.55 | v3.7,44.15 0.6,41.05 0.6,16.15 5.75,11 19.65,11 v21.05,9.6 | v24.1,39.75 23.75,39.75 23.75,41.45 v22.45,42.75
GATE  (via drill 0.5 pad 0.41)
  Top 0.254: v36.4,39.65 36.35,39.7 35.05,39.7 U1.24 | U$5.1 45.75,29.1 44.8,29.2
  Top 0.305: 44.8,29.2 41.5,32.5 v41.5,32.65
  Bottom 0.254: v41.5,32.65 41.5,34.9 39.4,37 38.6,37 37.7,37.9 37.7,38.5 36.85,39.35 36.85,39.65 v36.4,39.65
GND  (via drill 0.5, 0.5 pad 0.41, 0.5 pad 0.61, 0.5 pad 0.81)
  Top 0.254: 25,17.8 25.02,17.77 U$9.4 25.77,17.7 | IC2.PP@1 45.91,14.94 IC2.9 | 36.2,14.3 36.4,14.1 37.5,14.1 | 25.77,17.7 24.9,17.7 | 25.77,17.7 26.4,17.7 27.39,18.69 v27.39,19.38 | 35,14.8 34.99,14.81 IC1.9 | IC1.PP@2 35.5,13.9 35.6,13.9 35.99,13.51 IC1.4 | IC1.PP 35.85,13.8 37.8,13.8 37.5,14.1 | 37.5,14.1 37.3,14.3 36.7,14.3 36.8,14.4 37.8,14.4 37.6,14.2 37.5,14.2 37.7,14.4 38,14.4 37.9,14.5 33.2,14.5 33.4,14.3 34.7,14.3 34.5,14.1 33.2,14.1 33.4,13.9 34.8,13.9 34.7,13.8 33.2,13.8 33.05,13.65 C7.2 | 15.8,43.6 15.77,43.63 U2.6 | C2.1 20.6,38.25 20.6,39.1 20.7,39.2 21.2,39.2 21.7,39.7 22.6,39.7 24,38.3 24,38.1 24.1,38 24.7,38 | U3.18 U3.17 55.2,44 55.1,43.9 55.1,43.2 55.29,43.01 U3.15
  Top 0.305: IC2.PP@2 46.91,13.38 IC2.4 | U1.21 35.95,37.35 36.6,36.7 36.6,36.8 | 36.6,36.8 36.1,37.3 | v37.49,36.28 37.22,36.19 36.6,36.8 | C12.2 42.8,13.7 42.9,13.8 42.9,13.5 43,13.5 43.1,13.6 44.2,13.6 44.5,13.9 44.9,13.9 45.2,14.2 44.1,14.2 44.4,14.5 44.9,14.5 45,14.4 48.7,14.4 48.8,14.3 47.4,14.3 47.3,14.2 47.4,14.1 | 47.4,14.1 48.9,14.1 | 47.4,14.1 46.47,14.1 IC2.PP | IC1.PP@1 35.36,14.44 35,14.8 | 15.7,45 15.7,43.6 15.8,43.5 15.8,43.6 | U3.9 53.73,40.53 53.4,40.2 52.5,40.2 | 52,40.2 52.5,40.2 | 52.5,40.2 52.6,40.1 52.6,40 52.5,39.9 52.5,39 52.4,38.9 | U3.1 51.09,44.51 51,44.6 | U3.11 54.73,40.57 55.3,40 55.2,40 | 55.1,43.2 54.7,43.2 v54.4,43.5
  Top 0.406: IC1.PP@2 35.5,13.9 IC1.PP | U1.5 26.2,36.53 26.2,36.6 25,36.6 25,36.7 24.69,36.7 24.69,37.28 24.7,37.28 24.7,38 24.7,38.2 26.45,38.2 U1.3 | v15.71,40.74 15.71,41.78 | 20.3,31.15 20.5,31.15 | 20.5,31.15 20.5,31.8 20.2,31.8 | 20,31.8 19.8,31.8 19.8,30.8 20.2,30.8 20.2,31.8 | 20.2,31.8 20,31.8 | 20,31.8 20,31.7 19.5,31.7 19.5,32.2 17.39,32.2 v17.39,31.48 | 20.5,31.15 20.5,30.95 C3.1
  Bottom 0.254: TP7.TP 22.35,54.75 TP8.TP 21.9,54.65
  other vias: 40.4,39.8 41.6,39.8 49.2,39.8 42.8,39.8 45.3,39.8 46.6,39.8 47.9,39.8 40.4,41.1 41.6,41.1 49.2,41.1 42.8,41.1 44.1,41.1 45.3,41.1 46.6,41.1 47.9,41.1 40.4,43.7 41.6,43.7 49.2,43.7 42.8,43.7 44.1,43.7 45.3,43.7 46.58,43.7 47.9,43.7 40.4,42.4 41.6,42.4 49.2,42.4 42.8,42.4 44.1,42.4 45.3,42.4 46.6,42.4 47.9,42.4 40.4,45 41.6,45 49.2,45 42.8,45 44.1,45 45.3,45 46.6,45 47.9,45 8,2 8,8 8,4.6 8,3.3 12,2 12,10 12,8 12,4.6 12,3.3 51.3,4.45 51.3,3.15 51.3,1.85 47.5,1.85 47.5,3.15 47.5,4.45 7.69,29.29 13.69,48.88 12.49,37.69 7.99,19.18 20.09,43.59 24.59,36.39 3.99,48.98 38.19,52.38 43.69,24.38 11.49,17.39 39,46.4 1.75,33.48 13.29,40.59 25.89,45.09 47.29,35.69 24.09,23.88 21.39,21.88 25.79,28.88 10.29,22.88 26.19,24.59 28.69,22.88 48.79,26.98 55.39,21.98 50.89,13.88 54.99,30.38 50.49,36.59 42.09,21.98 27.99,14.98 41.39,16.89 57.89,24.48 55.29,13.98 52.09,22.68 20.29,45.69 16.79,49.59 37.69,12.98 36.79,16.79 36.69,20.29 41.69,12.29 41.09,19.18 38.79,7.88 18.49,5.69 22.89,14.38 54.59,9.68 2.89,4.79 1.79,28.59 35.05,41.11 9.19,35.53 47.5,5.68 51.31,5.69 8,5.9 12,5.9 7.99,9.98 50.5,46.4 50.5,38.4 39,39.8 39,41.1 39,43.7 39,42.4 39,45 39,38.4 50.5,39.8 50.5,41.1 50.5,43.7 50.5,42.4 50.5,45 15.59,47.19 43.59,28.79 44.1,39.8 51.5,48.1 14.89,51.89 16.79,53.79 23.29,44.59 58.6,47.1 55.3,51.3 10.09,14.59 6.79,39.73
  pour Bottom (isolate 0.406): 0,55.8 60,55.8 60,0 0,0
  pour Top (isolate 0.406): 0,55.8 60,55.8 60,0 0,0
GPSEN  (via drill 0.5, 0.5 pad 0.41)
  Top 0.254: v27.9,25.85 27.9,25.9 28,26 28,32.65 U1.9 | R8.1 43.8,34.4
  Top 0.305: v38.95,33.6 39.45,34.1 42.8,34.1 43.1,34.4 R8.1
  Bottom 0.254: 38.35,31.95 38.35,28.9 31.85,22.4 31.8,22.4 31.3,21.9 30.5,21.9 30.1,22.3 30.1,23.6 28.25,25.45 v27.9,25.85
  Bottom 0.305: 38.35,31.95 38.95,32.55 v38.95,33.6
HX1  (via drill 0.5 pad 0.41)
  Top 0.254: v17.8,38.05 17.8,37.85 v16.7,36.75 | 26.5,39.75 U1.1 26.17,39.73 24.9,40.9 v22.5,40.9 | v16.64,39.57 16.67,39.57 19.8,42.7 v21.15,42.7
  Bottom 0.254: v16.64,39.57 16.9,38.95 v17.8,38.05 | v16.7,36.75 16.7,37.05 15.85,37.9 15.15,37.9 12.3,35.05 12.3,19.55 24.05,7.8 U$3.TXD | v22.5,40.9 22.6,41.25 v21.15,42.7
LED
  Top 0.254: R5.2 30.2,30.7 29.6,31.3 29.6,32.65 U1.11
MISO  (via drill 0.5 pad 0.41)
  Top 0.254: v29.45,36.1 v32.6,36.1 | v23.8,30.55 23.8,30.25 22,28.45 U$7.10 | U1.16 33.55,34.11 v33.42,34.23 | v16.92,41.68 16.9,43.55 U2.7 16.8,43.65 v16.8,45.15
  Bottom 0.254: v29.45,36.1 29.35,36.1 25.61,32.36 | v23.8,30.55 25.61,32.36 | v16.8,45.15 16.8,47.2 14.8,49.2 14.2,49.8 13.1,50.9 9.8,50.9 8.7,49.8 7.2,49.8 5.9,51.1 4.8,51.1 3.1,52.8 2.94,52.64 J1.1 1.75,52.65 | v16.92,41.68 16.92,41.17 17.79,40.31 17.84,40.31 18.03,40.12 18.03,39.3 18.98,38.34 18.98,38.3 21.87,35.41 22.55,35.41 25.61,32.36 | v33.42,34.23 33.42,35.28 v32.6,36.1
MOSI  (via drill 0.5 pad 0.41)
  Top 0.254: v32.05,31.25 32.75,31.95 32.75,32.65 U1.15 | U2.3 12.45,43.6 12.45,43.85 12.4,43.9 12.4,44.85 | v18.55,30.75 19.95,29.35 19.95,28.1 U$7.11 20,27.8 21.45,26.35 25.95,26.35 v26.55,25.75 | J1.4 5.6,50.1 7.1,48.6 7.1,47.3 7.9,46.5 9.2,46.5 10.85,44.85 12.4,44.85 | 12.4,44.85 v12.68,45.11 | 19,39.35 19,39.5 19.55,40.05 v20.4,40.05
  Top 0.305: v16.9,35 17.2,35 19,36.8 19,39.35
  Bottom 0.254: v26.55,25.75 v32.05,31.25 | 19.2,31.7 18.55,31.05 v18.55,30.75 | v12.68,45.11 14.54,45.11 15.1,44.55 15.1,44.51 16.27,43.35 16.7,43.35 v20.4,40.05
  Bottom 0.305: 19.2,31.7 19.2,32.7 v16.9,35
N$1
  Top 0.254: R5.1 LED1.A
N$2
  Top 0.254: R8.2 45.85,34.2 Q1.1 | R8.2 45.9,34.15 45.9,34.1 | R7.1 45.65,33.05 R8.2
N$3
  Top 0.813: U$1.11_RF_IN 48.09,47.16 U$2.P$1
N$4  (via drill 0.5 pad 0.41)
  Top 0.254: v37.5,34.8 35.8,36.5 35.05,36.5 U1.20 | C5.1 39.7,29.7 39.4,30 38.75,30 v37.5,31.25
  Bottom 0.254: v37.5,34.8 v37.5,31.25
N$5
  Bottom 0.813: X1.1 49.4,7.68 U$3.RFOUT
N$6
  Top 0.254: U$1.7_VCC_IO 46.99,37.67 48.04,37.67 U$1.8_VCC 48.19,37.67 49.09,37.67 U$1.9_V_RESET 49.15,37.52 49.15,33.98 49.8,33.33 Q1.3 | Q1.3 54.09,33.25 C6.1 | 49.75,33.38 Q1.3
N$7  (via drill 0.5 pad 0.41)
  Top 0.305: v35.8,11 35.49,11.31 IC1.3
  Top 0.813: U$4.P$1 38.97,17.67 38.9,17.6 v38.9,16.1
  Bottom 0.813: v38.9,16.1 38.9,11.4 38.5,11 v35.8,11
N$9
  Bottom 0.406: TP11.TP TP12.TP
N$10
  Bottom 0.813: BAT2.PWR@1 BAT1.GND@1
N$11  (via drill 0.5)
  Top 0.254: SJ5.1 24.75,53.4 25.48,54.12 32.45,54.12 v37.2,49.38 | v37,40.9 37.4,40.1 37.4,37.5 39.24,35.74 39.31,35.67 41.35,35.67 42.52,36.85 42.52,37.5 U$1.3_RXD1
  Top 0.305: U$1.3_RXD1 42.58,37.85
  Bottom 0.254: v37.2,49.38 37.3,40.7 v37,40.9
N$12  (via drill 0.5)
  Top 0.254: 41.44,37.57 41.44,37.62 U$1.2_TXD1 41.4,37.45 41.4,36.6 41,36.2 39.83,36.2 38.02,38 38.02,41.77 37.7,42.1 v36.33,42.1 | SJ6.1 24.75,50.5 25.48,51.23 28.7,51.23 32.85,47.08 v35.98,47.08
  Bottom 0.254: v35.98,47.08 35.98,42.45 v36.33,42.1
N$13
  Top 0.813: U$8.1 10.05,11.95 U$7.1
N$14
  Bottom 0.406: TP15.TP TP16.TP
N$15
  Top 0.254: SJ1.2 32.4,44.55 33,45.15 33,46.1 33.1,46.2 36.7,46.2 39.48,48.98 41.5,48.98 42.58,47.9 42.58,47.17 U$1.16_SDA2
N$16
  Top 0.254: SJ3.2 35.77,44.55 39.67,48.45 40.92,48.45 41.48,47.9 41.48,47.17 U$1.17_SCL2
N$17
  Top 0.254: C15.1 54.23,39.25 U3.10
N$18
  Top 0.254: 56.3,48.6 56.2,48.5 56.2,48.3 54.73,46.83 U3.20
  Top 0.406: C14.1 56.3,48.75 56.3,48.6
N$19  (via drill 0.5 pad 0.41)
  Top 0.305: v46.5,10.4 46.4,10.5 IC2.3
  Top 0.813: U$6.P$1 48.62,21.28 v50,19.9
  Bottom 0.305: 46.5,10.3 v46.5,10.4
  Bottom 0.813: v50,19.9 50,19.8 52.6,17.2 52.6,11.5 51.1,10 46.7,10 46.6,10.1 46.6,10.2 46.5,10.3
N$20
  Top 0.254: Y1.P$1 22.05,32.55 | U1.8 26.5,34.1 23.65,34.1 22.2,32.65 Y1.P$1 | C3.2 22.1,31.05 Y1.P$1
N$21
  Top 0.254: U1.7 26.5,34.95 23.6,34.95 22.2,36.35 Y1.P$2
  Top 0.305: C2.2 22.25,36.55 Y1.P$2
N$23
  Bottom 0.406: TP14.TP TP13.TP
N$25
  Bottom 0.406: TP10.TP TP9.TP
N$26
  Top 0.305: ON----OFF.2 5,30.5 5.5,31 11.5,31 12,30.5 U$7.15
N$29
  Top 0.254: U$7.3 14,11.8 15.8,10 20.2,10 22,11.8 U$7.7
N$30
  Top 0.254: U$7.4 16,11.7 17.15,10.55 18.85,10.55 20,11.7 U$7.6
RESET  (via drill 0.5 pad 0.41)
  Top 0.254: v2,45.4 2,40.2 R2.1 | v29.3,39.35 30.35,40.4 30.35,41.15 U1.29 | v2,45.4 v8.7,45.4 | 1.95,45.4 v2,45.4
  Bottom 0.254: v2,45.4 2.05,47.25 1.75,47.55 J1.5 | v29.3,39.35 28.35,38.4 27.4,38.4 26.3,39.5 26.3,42.4 26,42.7 23.7,42.7 21.7,44.7 19.1,44.7 18.6,44.2 17,44.2 16.55,44.2
  Bottom 0.305: v8.7,45.4 11.7,45.4 12.3,46 14.6,46 16.4,44.2 17,44.2
RFM22_NIRQ  (via drill 0.5 pad 0.41)
  Top 0.254: v15.5,37.05 20.35,41.8 27.2,41.8 27.92,41.18 U1.32 27.95,41.15 | v15.25,30.55 15.25,29.45 14,28.2 U$7.14
  Bottom 0.254: v15.5,37.05 15.5,30.8 v15.25,30.55
RFM22_NSEL  (via drill 0.5 pad 0.41)
  Top 0.254: U1.14 32,32.7 32,34.12 v32.09,34.21 | U$7.13 16,26.3 14.3,24.6 v14.2,24.6
  Bottom 0.254: v32.09,34.21 23.1,24.9 22.8,24.6 v14.2,24.6
SCK  (via drill 0.5 pad 0.3, 0.5 pad 0.41)
  Top 0.254: v39.2,30.95 39,30.95 35.85,34.1 35.05,34.1 U1.17 | U$7.12 18,27.8 | 14.65,42.1 14.65,32.35 17.95,29.05 17.95,28.1 U$7.12 | 14.65,42.1 14.65,43.55 U2.5 | v14.55,42.1 14.65,42.1 | v26.2,23.2 24.8,21.8 23.8,21.8 18,27.6 U$7.12
  Bottom 0.254: v39.2,30.95 39.2,29 31.5,21.3 27,21.3 26.2,22.1 v26.2,23.2 | J1.3 5.1,50.1 6,49.2 6,45.3 5.8,45.1 5.8,41.5 6.1,41.2 8.6,41.2 9.9,42.5 14.05,42.5 14.1,42.55 v14.55,42.1
SCL  (via drill 0.5)
  Top 0.254: U3.23 53.26,45.26 | U3.23 53.23,46.13 | 53.23,46.13 54,46.9 v54,48.3 | v32.9,42.7 33.2,43 33.2,44.3 33.6,44.7 33.6,45.2 33.85,45.45 SJ3.1 | v30.8,38.5 30.8,38.7 31.1,39 31.1,41.11 U1.28 | R4.1 31.95,23.65 v31.1,22.9 | U3.23 53.2,45.29 53.2,46.1 53.23,46.13 | v45.9,26.9 45.3,27.5 40.5,27.5 39.5,28.5 37.3,28.5 34.5,31.3 v34.5,32.5
  Top 0.305: 34.65,45.3 SJ3.1
  Bottom 0.254: 58,41.6 I2C.4 59.4,43.02 59.4,45 58.6,45.8 57.8,45.8 55.3,48.3 v54,48.3 | 32.7,43.3 32.7,42.9 | 32.7,42.9 v32.9,42.7 | 32.7,42.9 31.9,42.9 31.8,42.9 31.1,42.2 31.1,38.8 v30.8,38.5 30.7,38.4 32,38.4 34.5,35.9 v34.5,32.5 30.6,28.6 30.6,27.9 31.1,27.4 v31.1,22.9 | 51.6,32.9 45.9,27.2 v45.9,26.9
  Bottom 0.305: 26.9,54.4 29.1,54.4 29.6,53.9 29.6,49.7 32.7,46.6 32.7,43.3 | 51.6,32.9 52.8,34.1 55.2,34.1 55.7,34.6 55.7,40.1 57.22,41.62 I2C.4 | TP1.TP TP2.TP 23,47.09 | 23,47.09 23,47 | 23,47.09 23.02,47.1 25.7,47.1 29.9,42.9 31.9,42.9
SD_CS  (via drill 0.5 pad 0.41)
  Top 0.254: v29.45,34.15 30.35,34.15 U1.12 | v23.85,32.4 v26.85,32.4 | U2.2 11.4,43.15 11.55,43 11.45,42.9 11.2,42.9 11.3,43 11.3,41.7 10.15,40.55 v10.15,40.5
  Bottom 0.254: v29.45,34.15 27.7,32.4 v26.85,32.4 | v23.85,32.4 22.25,32.4 15.43,39.23 15.4,39.2 11.9,39.2 10.6,40.5 v10.15,40.5
SDA  (via drill 0.5, 0.5 pad 0.25, 0.5 pad 0.3, 0.5 pad 0.41)
  Top 0.254: v31.8,28.3 31.8,26.95 31.7,26.85 R3.1 31.9,26.6 | 31.8,28.4 v31.8,28.3 | v32.08,39.48 32,39.57 32,40 32,40.4 32,41.15 U1.27 31.9,41.3 31.9,42 30.3,43.6 30.3,46.5 v30.8,47 | v30.8,47 30.8,46.45 SJ1.1 | 30.77,46.98 v30.8,47 | 31.8,26.6 31.9,26.6 | 31.9,26.6 32,26.5 31.8,26.5 v31.8,28.3 | U3.24 52.73,47.07 v52.7,47.1 | v41,26.4 40.6,26.4 39.1,27.9 36.1,27.9 v35.2,28.8
  Bottom 0.254: v32.08,39.48 35.4,36.6 35.4,31.9 33.9,30.4 | 58,44.2 I2C.5 | 57.95,44.33 I2C.5 | 27.93,46.9 30.7,46.9 v30.8,47 | 52.8,47.1 v52.7,47.1 52.6,47.2 52.7,47.2 52.8,47.1 | 52.8,47.1 55.06,47.1 I2C.5 | 33.9,30.4 v31.8,28.3 | 33.9,30.4 33.9,30.1 v35.2,28.8 35.3,28.8 | 52.8,47.1 52.8,38.7 51.5,37.4 51.5,35 50.2,33.7 50.2,33.1 43.5,26.4 v41,26.4
  Bottom 0.305: 27.93,46.9 26.52,48.3 24.1,48.3 22.96,49.44 TP3.TP TP4.TP
TEMP
  Top 0.254: U$9.1 25.85,19.75 25.85,20.3 27,21.45 R14.1 27.1,21.55 27.1,24.6 27.5,25 28.3,25 28.75,25.45 U1.10 28.75,32.65
UBLOX_RXD
  Top 0.254: TX.1 26.15,52.8 | 26.15,52.8 SJ5.2 | U1.31 28.75,41.2 28.75,44.4 24.05,49.1 24.05,50.7 25.1,51.75 25.2,51.75 26.15,52.7 26.15,52.8
UBLOX_TXD
  Top 0.254: SJ6.2 RX.1 28.05,49.8 29.55,48.3 29.55,41.2 U1.30
VAUX
  Top 0.254: C13.1 44.64,12.69 IC2.1
VAUX1
  Top 0.254: IC1.1 34.49,12.41 34.5,12.4 33.8,12.4 33.3,11.9 C9.1
VBATT  (via drill 0.5 pad 0.41)
  Top 0.254: 36.52,12.69 IC1.5 37.08,12.1 37.1,12.1 37.3,11.9
  Top 0.305: IC2.7 IC2.8 | IC2.5 47.41,11.59 47.7,11.3 v49,11.3 | IC1.8 35.49,15.99 35.7,16.2 35.7,15.85 35.91,15.63 IC1.7
  Top 0.6: 37.3,11.9 37.1,11.7
  Top 0.61: U$6.P$2 44.05,21.56 44.05,17.75 44.3,17.5 45.3,17.5 | 46.91,15.89 IC2.7 | 33.9,18.1 35.7,16.3 35.7,16.2
  Top 0.813: IC2.7 IC2.6 | IC2.6 47.8,15.8 48.8,15.8 v48.95,15.95 53.55,20.55 BAT1.PWR@1 | VBATT.1 55.35,19 53.95,20.4 BAT1.PWR@1 | U$5.3 46.15,24.35 48.2,24.35 52.5,20.05 BAT1.PWR@1 | R1.2 36.8,24.45 36.8,23.8 | 36.8,23.8 34.69,21.68 | 34.69,21.68 U$4.P$2 | 34.69,21.68 34.5,21.5 34.5,19.1 33.9,18.5 33.9,18.4 33.6,18.1 | 33.6,18.1 32.2,16.7 27.8,16.7 26.4,15.3 26.4,11.3 27.2,10.3 34.2,10.3 35.2,9.5 36.1,9.5 37.1,10.5 37.1,11.7 | 33.9,18.1 33.6,18.1 | 36.8,23.8 37.3,23.3 C1.1 C10.1 42.8,23.3 44.18,21.92 U$6.P$2 | 45.3,17.5 45,17.5 44.9,17.6 45.4,17.6 46.5,16.5 46.55,16.5 IC2.6
  Bottom 0.813: v49,11.3 49,15.9 v48.95,15.95
VBATTADC  (via drill 0.5 pad 0.41)
  Top 0.254: 35.05,38.9 U1.23 35.95,38.95 36.55,38.35 v36.55,38.15 | R1.1 35.3,24.65 | R6.2 36.2,26.7 36.1,26.8
  Top 0.305: R1.1 35.1,24.55 v35.1,26.9 35.2,26.8 36.1,26.8 36.7,26.8
  Bottom 0.254: 36.55,28.45 v36.55,38.15
  Bottom 0.305: 36.55,28.45 v35.1,26.9

### Text on the board
tNames: Soft_Serial / A3-A2 | SDA | SCL | . | . | . | VBatt | . | . | . | 3V3 | 5V | BALUA.ORG | All-In-One HAB Tracker | V2.0
bNames: BALUA.ORG | V2.0 | All-In-One HAB Tracker